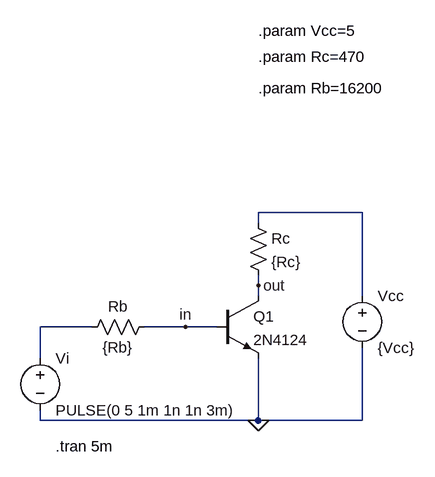
[diagram p0: schematic Lab1-part1_lx.asc]
Lab1-part1_lx.asc, the LTspice schematic file:
Version 4
SHEET 1 880 680
WIRE 352 48 192 48
WIRE 192 64 192 48
WIRE 192 160 192 144
WIRE 192 176 192 160
WIRE 352 176 352 48
WIRE -64 224 -144 224
WIRE 80 224 16 224
WIRE 128 224 80 224
WIRE -144 272 -144 224
WIRE -144 368 -144 352
WIRE 192 368 192 272
WIRE 192 368 -144 368
WIRE 352 368 352 256
WIRE 352 368 192 368
FLAG 192 368 0
FLAG 80 224 in
FLAG 192 160 out
SYMBOL npn 128 176 R0
SYMATTR InstName Q1
SYMATTR Value 2N4124
SYMBOL voltage 352 160 R0
WINDOW 123 0 0 Left 0
WINDOW 39 0 0 Left 0
SYMATTR InstName Vcc
SYMATTR Value {Vcc}
SYMBOL res 176 48 R0
SYMATTR InstName Rc
SYMATTR Value {Rc}
SYMBOL res 32 208 R90
WINDOW 0 0 56 VBottom 2
WINDOW 3 32 56 VTop 2
SYMATTR InstName Rb
SYMATTR Value {Rb}
SYMBOL voltage -144 256 R0
WINDOW 123 0 0 Left 0
WINDOW 39 0 0 Left 0
SYMATTR InstName Vi
SYMATTR Value PULSE(0 5 1m 1n 1n 3m)
TEXT -120 408 Left 2 !.tran 5m
TEXT 192 -232 Left 2 !.param Vcc=5
TEXT 192 -192 Left 2 !.param Rc=470
TEXT 192 -144 Left 2 !.param Rb=16200

The netlist it stands for:
* Lab1-part1_lx.asc
Q1 out in 0 0 2N4124
Vcc N001 0 {Vcc}
Rc N001 out {Rc}
Rb in N002 {Rb}
Vi N002 0 PULSE(0 5 1m 1n 1n 3m)
.model NPN NPN
.model PNP PNP
.lib standard.bjt
.tran 5m
.param Vcc=5
.param Rc=470
.param Rb=16200
.backanno
.end